# Altium project S7V30_K66BLEZ.PrjPCB
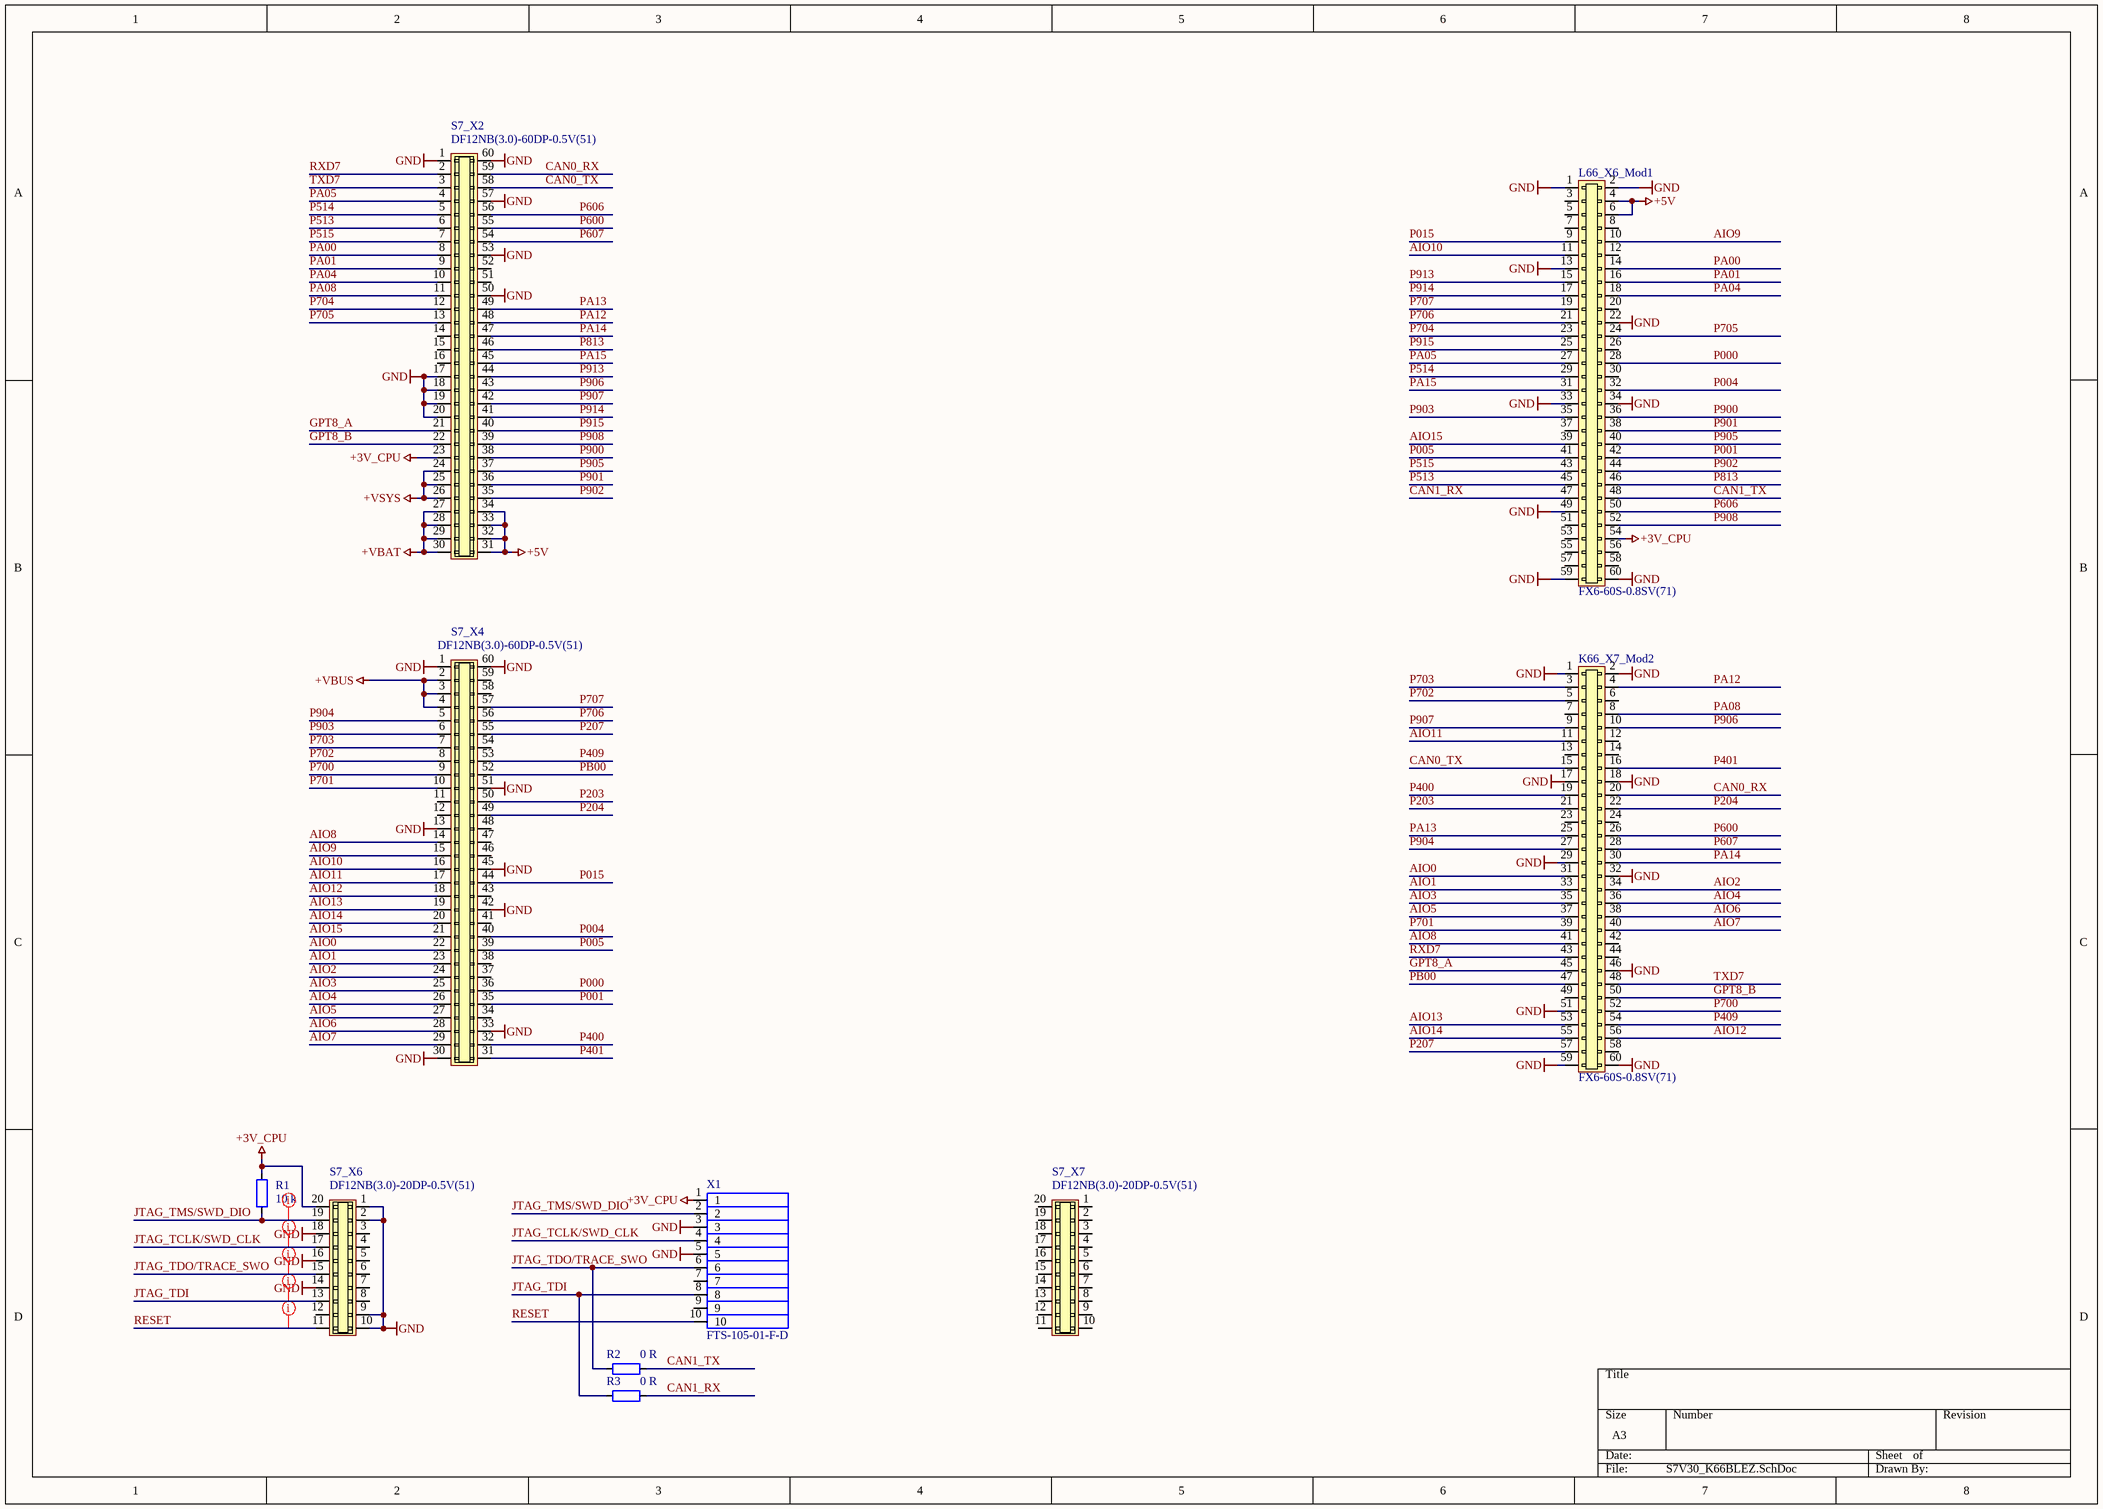
[diagram p0: S7V30_K66BLEZ.SchDoc]
1 sheet, 10 parts. Net scope: global (net labels, ports and power ports of the same name join across sheets).
Board file: S7V30_K66BLEZ.PcbDoc

## Sheet S7V30_K66BLEZ.SchDoc
size A3

### Parts
K66_X7_Mod2  FX6-60S-0.8SV(71)  [FX6-60S-0.8SV(71)]
L66_X6_Mod1  FX6-60S-0.8SV(71)  [FX6-60S-0.8SV(71)]
R1  value 10 k  [0402]  (hidden comment: RMCF0402FT10K0)
R2  value 0 R  [0603]  (hidden comment: RK73Z1JTTD)  (no BOM)
R3  value 0 R  [0603]  (hidden comment: RK73Z1JTTD)  (no BOM)
S7_X2  DF12NB(3.0)-60DP-0.5V(51)  [DF12NB(3.0)-60DP-0.5V(51)]
S7_X4  DF12NB(3.0)-60DP-0.5V(51)  [DF12NB(3.0)-60DP-0.5V(51)]
S7_X6  DF12NB(3.0)-20DP-0.5V(51)  [DF12NB(3.0)-20DP-0.5V(51)]
S7_X7  DF12NB(3.0)-20DP-0.5V(51)  [DF12NB(3.0)-20DP-0.5V(51)]
X1  FTS-105-01-F-D  [FTS-105-01-F-D]

### Nets
+3V_CPU: L66_X6_Mod1.54 R1.2 S7_X2.23 S7_X6.20 X1.1
+5V: L66_X6_Mod1.4 L66_X6_Mod1.6 S7_X2.31 S7_X2.32 S7_X2.33 S7_X2.34
+VBAT: S7_X2.27 S7_X2.28 S7_X2.29 S7_X2.30
+VBUS: S7_X4.2 S7_X4.3 S7_X4.4
+VSYS: S7_X2.24 S7_X2.25 S7_X2.26
GND: K66_X7_Mod2.1 K66_X7_Mod2.2 K66_X7_Mod2.17 K66_X7_Mod2.18 K66_X7_Mod2.29 K66_X7_Mod2.32 K66_X7_Mod2.46 K66_X7_Mod2.51 K66_X7_Mod2.59 K66_X7_Mod2.60 L66_X6_Mod1.1 L66_X6_Mod1.2 L66_X6_Mod1.13 L66_X6_Mod1.22 L66_X6_Mod1.33 L66_X6_Mod1.34 L66_X6_Mod1.49 L66_X6_Mod1.59 L66_X6_Mod1.60 S7_X2.1 S7_X2.17 S7_X2.18 S7_X2.19 S7_X2.20 S7_X2.50 S7_X2.53 S7_X2.57 S7_X2.60 S7_X4.1 S7_X4.13 S7_X4.30 S7_X4.33 S7_X4.42 S7_X4.45 S7_X4.51 S7_X4.60 S7_X6.1 S7_X6.2 S7_X6.9 S7_X6.10 S7_X6.14 S7_X6.16 S7_X6.18 X1.3 X1.5
AIO0: K66_X7_Mod2.31 S7_X4.22
AIO1: K66_X7_Mod2.33 S7_X4.23
AIO2: K66_X7_Mod2.34 S7_X4.24
AIO3: K66_X7_Mod2.35 S7_X4.25
AIO4: K66_X7_Mod2.36 S7_X4.26
AIO5: K66_X7_Mod2.37 S7_X4.27
AIO6: K66_X7_Mod2.38 S7_X4.28
AIO7: K66_X7_Mod2.40 S7_X4.29
AIO8: K66_X7_Mod2.41 S7_X4.14
AIO9: L66_X6_Mod1.10 S7_X4.15
AIO10: L66_X6_Mod1.11 S7_X4.16
AIO11: K66_X7_Mod2.11 S7_X4.17
AIO12: K66_X7_Mod2.56 S7_X4.18
AIO13: K66_X7_Mod2.53 S7_X4.19
AIO14: K66_X7_Mod2.55 S7_X4.20
AIO15: L66_X6_Mod1.39 S7_X4.21
CAN0_RX: K66_X7_Mod2.20 S7_X2.59
CAN0_TX: K66_X7_Mod2.15 S7_X2.58
CAN1_RX: L66_X6_Mod1.47 R3.2
CAN1_TX: L66_X6_Mod1.48 R2.2
GPT8_A: K66_X7_Mod2.45 S7_X2.21
GPT8_B: K66_X7_Mod2.50 S7_X2.22
JTAG_TCLK/SWD_CLK: S7_X6.17 X1.4
JTAG_TDI: R3.1 S7_X6.13 X1.8
JTAG_TDO/TRACE_SWO: R2.1 S7_X6.15 X1.6
JTAG_TMS/SWD_DIO: R1.1 S7_X6.19 X1.2
P000: L66_X6_Mod1.28 S7_X4.36
P001: L66_X6_Mod1.42 S7_X4.35
P004: L66_X6_Mod1.32 S7_X4.40
P005: L66_X6_Mod1.41 S7_X4.39
P015: L66_X6_Mod1.9 S7_X4.44
P203: K66_X7_Mod2.21 S7_X4.50
P204: K66_X7_Mod2.22 S7_X4.49
P207: K66_X7_Mod2.57 S7_X4.55
P400: K66_X7_Mod2.19 S7_X4.32
P401: K66_X7_Mod2.16 S7_X4.31
P409: K66_X7_Mod2.54 S7_X4.53
P513: L66_X6_Mod1.45 S7_X2.6
P514: L66_X6_Mod1.29 S7_X2.5
P515: L66_X6_Mod1.43 S7_X2.7
P600: K66_X7_Mod2.26 S7_X2.55
P606: L66_X6_Mod1.50 S7_X2.56
P607: K66_X7_Mod2.28 S7_X2.54
P700: K66_X7_Mod2.52 S7_X4.9
P701: K66_X7_Mod2.39 S7_X4.10
P702: K66_X7_Mod2.5 S7_X4.8
P703: K66_X7_Mod2.3 S7_X4.7
P704: L66_X6_Mod1.23 S7_X2.12
P705: L66_X6_Mod1.24 S7_X2.13
P706: L66_X6_Mod1.21 S7_X4.56
P707: L66_X6_Mod1.19 S7_X4.57
P813: L66_X6_Mod1.46 S7_X2.46
P900: L66_X6_Mod1.36 S7_X2.38
P901: L66_X6_Mod1.38 S7_X2.36
P902: L66_X6_Mod1.44 S7_X2.35
P903: L66_X6_Mod1.35 S7_X4.6
P904: K66_X7_Mod2.27 S7_X4.5
P905: L66_X6_Mod1.40 S7_X2.37
P906: K66_X7_Mod2.10 S7_X2.43
P907: K66_X7_Mod2.9 S7_X2.42
P908: L66_X6_Mod1.52 S7_X2.39
P913: L66_X6_Mod1.15 S7_X2.44
P914: L66_X6_Mod1.17 S7_X2.41
P915: L66_X6_Mod1.25 S7_X2.40
PA00: L66_X6_Mod1.14 S7_X2.8
PA01: L66_X6_Mod1.16 S7_X2.9
PA04: L66_X6_Mod1.18 S7_X2.10
PA05: L66_X6_Mod1.27 S7_X2.4
PA08: K66_X7_Mod2.8 S7_X2.11
PA12: K66_X7_Mod2.4 S7_X2.48
PA13: K66_X7_Mod2.25 S7_X2.49
PA14: K66_X7_Mod2.30 S7_X2.47
PA15: L66_X6_Mod1.31 S7_X2.45
PB00: K66_X7_Mod2.47 S7_X4.52
RESET: S7_X6.11 X1.10
RXD7: K66_X7_Mod2.43 S7_X2.2
TXD7: K66_X7_Mod2.48 S7_X2.3

Not connected (* = marked no-connect by the designer): K66_X7_Mod2 6(4) 7(4) 12(7) 13(7) 14(8) 23(12) 24(13) 42(22) 44(23) 49(25) 58(30); L66_X6_Mod1 3(2) 5(3) 7(4) 8(5) 12(7) 20(11) 26(14) 30(16) 37(19) 51(26) 53(27) 55(28) 56(29) 57(29) 58(30); S7_X2 14 15 16 51 52; S7_X4 11 12 34 37 38 41 43 46 47 48 54 58 59; S7_X6 3(2) 4(3) 5(3) 6(4) 7(4) 8(5) 12(7); S7_X7 1 2 3(2) 4(3) 5(3) 6(4) 7(4) 8(5) 9(5) 10(6) 11(6) 12(7) 13(7) 14(8) 15(8) 16(9) 17(9) 18(10) 19(10) 20(11); X1 7 9

### Layout directives
net class SWD: JTAG_TCLK/SWD_CLK, JTAG_TDI, JTAG_TDO/TRACE_SWO, JTAG_TMS/SWD_DIO, RESET

### Library data of the parts
K66_X7_Mod2 L66_X6_Mod1 = FX6-60S-0.8SV(71): RECEPT 60POS .8MM W/BOSS; Manufacturer: Hirose Electric Co Ltd; PartNum: H10806-ND; Price: 3.7$; Distributor: DigiKey; PartName: FX6-60S-0.8SV(71)
R1 = RMCF0402FT10K0: 10 kOhms, ±1%, 0.063W, 1/16W, Thick Film, ±100ppm/°C, 0402 (1005 Metric), -55°C ~ 155°C, Automotive AEC-Q200; Manufacturer: Stackpole Electronics Inc; PartNum: RMCF0402FT10K0CT-ND; Voltage: 75V; Distributor: Digi-Key; Price: 0.10000; Tolerance: ±1%; PartName: RMCF0402FT10K0; Part Number: RMCF0402FT10K0; Temperature Coefficient: ±100ppm/°C; Operating Temperature: -55°C ~ 155°C; Power (Watts): 0.063W, 1/16W; Features: Automotive AEC-Q200; Package / Case: 0402 (1005 Metric)
R2 R3 = RK73Z1JTTD: 0 Ohms Jumper Chip Resistor 0603 (1608 Metric) Automotive AEC-Q200, Moisture Resistant Metal Element, -55°C ~ 155°C; Manufacturer: KOA Speer Electronics, Inc.; PartNum: 2019-RK73Z1JTTDCT-ND; Distributor: Digi-Key; Price: 0.007$; PartName: RK73Z1JTTD
S7_X2 S7_X4 = DF12NB(3.0)-60DP-0.5V(51): 60 Position Connector Header, Outer Shroud Contacts Surface Mount Gold, height 2.3 mm, pitch 0.5 mm, Mated Stacking Heights 3mm; Manufacturer: Hirose Electric; PartNum: 26-DF12NB(3.0)-60DP-0.5V(51)CT-ND - Cut Tape (CT); Price: 1.27$; Distributor: Digi-Key; PartName: DF12NB(3.0)-60DP-0.5V(51)
S7_X6 S7_X7 = DF12NB(3.0)-20DP-0.5V(51): 20 Position Connector Header, Outer Shroud Contacts Surface Mount Gold, height 2.3 mm, pitch 0.5 mm, Mated Stacking Heights 3mm; Manufacturer: Hirose Electric; PartNum: 26-DF12NB(3.0)-20DP-0.5V(51)CT-ND; Price: 062$; Distributor: Digi-Key; PartName: DF12NB(3.0)-20DP-0.5V(51)
X1 = FTS-105-01-F-D: Board-To-Board Connector, Vertical, FTS Series, Through Hole, Header, 10, 1.27 mm; Manufacturer: SAMTEC; PartNum: 1928242; Distributor: Farnell; PartName: FTS-105-01-F-D